# EAGLE design USB_Micro_B (EAGLE 9.6.2)
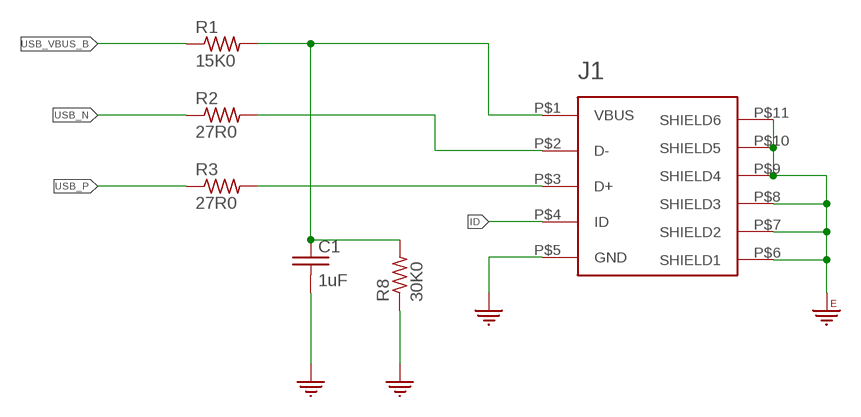
[diagram p0: schematic, sheet 1]

## Parts
C1  1uF  C_0402  [0402]
J1  USB-B-Micro  USB_MICRO-B  [USB_MICRO-B]
R1  15K0  R_0402  [0402]
R2  27R0  R_0402  [0402]
R3  27R0  R_0402  [0402]
R8  30K0  R_0402  [0402]

## Nets
D+1: J1.P$3(D+) R3.2
D-1: J1.P$2(D-) R2.2
GND: C1.2 J1.P$5(GND) R8.1
GNDE: J1.P$6(SHIELD1) J1.P$7(SHIELD2) J1.P$8(SHIELD3) J1.P$9(SHIELD4) J1.P$10(SHIELD5) J1.P$11(SHIELD6)
ID: J1.P$4(ID)
USB_N: R2.1
USB_P: R3.1
USB_VBUS_B: R1.1
VBUS1: C1.1 J1.P$1(VBUS) R1.2 R8.2

## Library data of the parts
C1 = 3D_MIG_Controller:C_0402
J1 = 3D_MIG_Controller:USB_MICRO-B; PARTNO: 10118192-0002LF
R1-R3 R8 = 3D_MIG_Controller:R_0402

## Board
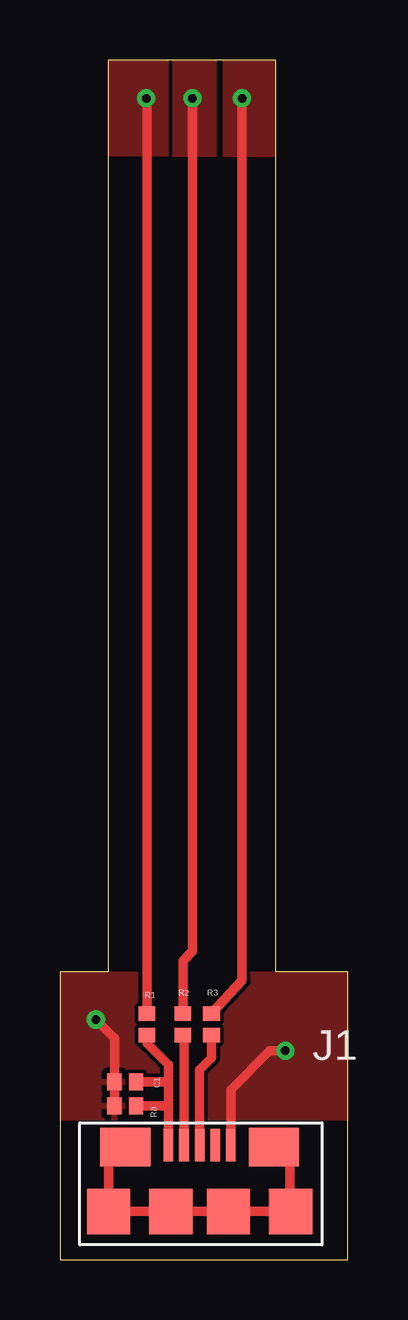
[diagram p1: board, top side]
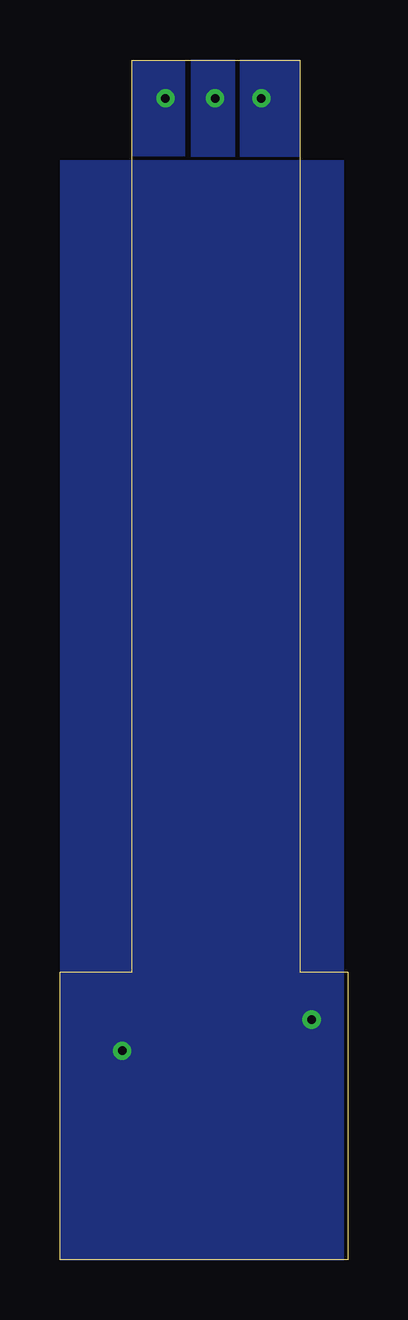
[diagram p2: board, bottom side, seen from below]

Size 12 x 50 mm. Coordinates in mm from the lower left corner, seen from the top.
Outline: 0,0 12,0 12,12 9,12 9,50 2,50 2,12 0,12 0,0
Copper layers (1*16): Top 0.035mm / dielectric 1.5mm / Bottom 0.035mm
Design rules "default *": minimum track width 6mil, minimum drill 0.35mm, track to track 6mil, track to pad 6mil, pad to pad 6mil, via to via 6mil, smd to smd 6mil, copper to edge 0mil, drill to drill 0mil, minimum pad ring 10mil, minimum via ring 8mil, stop-mask expansion 4mil, vias tented up to drill 0mil, thermal gap 10mil

### Footprints (pad centres in the part's own frame; a part is rotated, then mirrored left to right if it is on the bottom)
0402 = smd 0.7 x 0.6: 1 0,0.45; 2 0,-0.45
USB_MICRO-B = smd 0.4 x 1.35: P$1 -1.3,2.77; P$2 -0.65,2.77; P$3 0,2.77; P$4 0.65,2.77; P$5 1.3,2.77 | smd 2.1 x 1.6: P$6 -3.1,2.675; P$7 3.1,2.675 | smd 1.8 x 1.9: P$8 -3.8,0; P$9 3.8,0; P$10 -1.2,0; P$11 1.2,0

### Placement (x,y rotation side)
C1  2.73,7.41 270 top
J1  5.83,2.01 0 top
R1  3.63,9.81 0 top
R2  5.13,9.81 0 top
R3  6.33,9.81 0 top
R8  2.73,6.41 90 top

### Tracks (layer width: path | path; a pad name or v marks a point on that pad's centre or on a via)
D+1
  Top 0.4: R3.2 6.33,8.41 5.83,7.91 J1.P$3
D-1
  Top 0.4: R2.2 5.18,9.16 J1.P$2
GND  (via drill 0.35)
  Top 0.4: J1.P$5 7.13,7.08 8.74,8.7 v9.4,8.7 | R8.1 C1.2 2.28,9.22 v1.5,10
  pour Top: 0,12 12,12 12,5.8 0,5.8
  pour Bottom: 0.15,0 0.15,45.81 12,45.81 12,0
GNDE
  Top 0.4: 9.6,2.01 J1.P$11 J1.P$10 J1.P$8 2.03,3.98 J1.P$6 | 9.6,2.01 J1.P$9 | J1.P$7 9.6,4.01 9.6,2.01
USB_N  (via drill 0.35)
  Top 0.4: R2.1 5.13,12.46 5.53,12.86 5.53,48.33 v5.53,48.4
  pour Bottom: 6.53,50 6.53,46 4.7,46 4.7,50
  pour Top: 6.53,50 4.7,50 4.7,46 6.53,46
USB_P  (via drill 0.35)
  Top 0.4: R3.1 7.6,11.63 v7.6,48.4
  pour Top: 9,50 6.8,50 6.8,46 9,46
  pour Bottom: 9,50 6.8,50 6.8,46 9,46
USB_VBUS_B  (via drill 0.35)
  Top 0.4: 3.73,10.36 R1.1 3.63,48.33 v3.6,48.4
  pour Top: 2,50 4.5,50 4.5,46 2,46
  pour Bottom: 2,50 4.5,50 4.5,46 2,46
VBUS1
  Top 0.4: J1.P$1 4.53,6.41 | 4.53,7.41 4.53,8.11 3.63,9.01 R1.2 | 4.53,7.41 4.53,6.41 | R8.2 4.53,6.41 | C1.1 4.53,7.41